# Altium schematic sheet k26_baseboard_cameras.SchDoc: k26 Baseboard Cameras
size A4; DrawnBy: Ch. Vogt; Organization: PBL; DocumentNumber: 1; Revision: r5; SheetNumber: 8
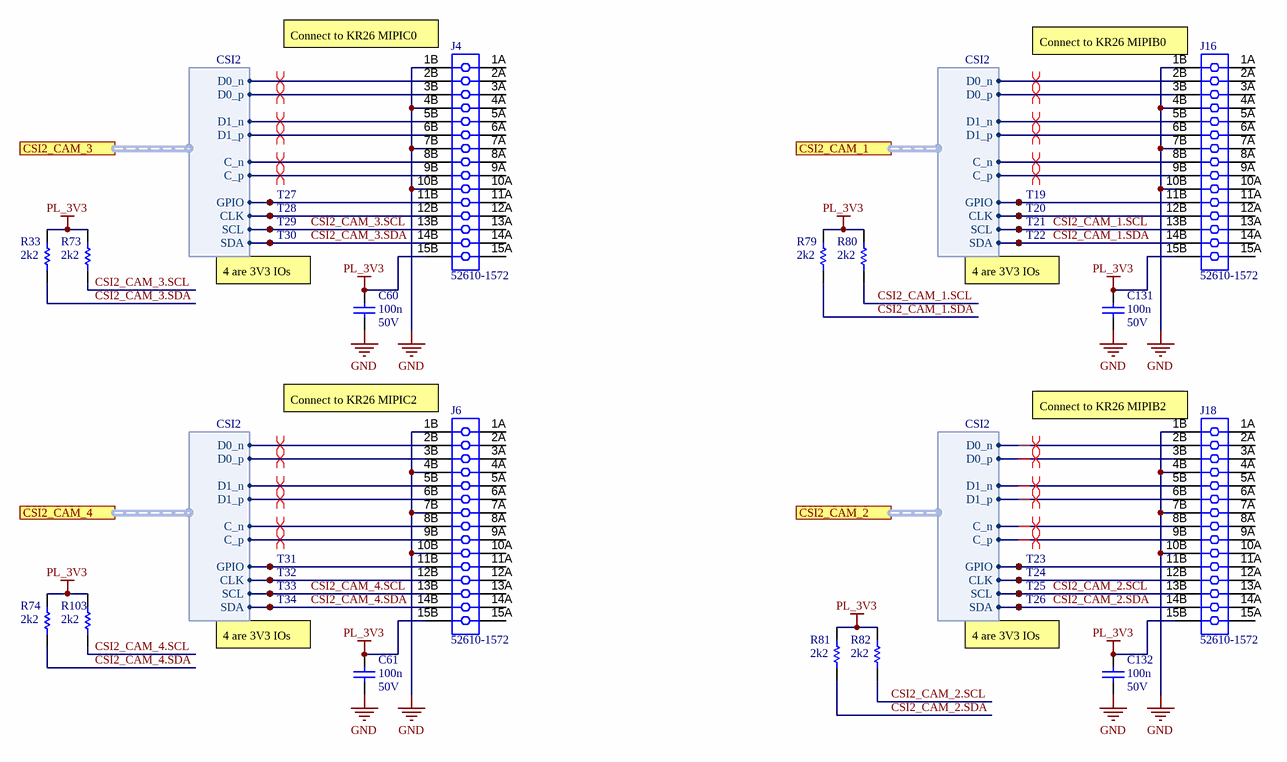
[diagram p0: k26_baseboard_cameras.SchDoc]

## Parts
C60  100n  Rated DC Voltage (URdc): 50V  [CAPC0402]
C61  100n  Rated DC Voltage (URdc): 50V  [CAPC0402]
C131  100n  Rated DC Voltage (URdc): 50V  [CAPC0402]
C132  100n  Rated DC Voltage (URdc): 50V  [CAPC0402]
J4  52610-1572  [MOLX-52610-1572]
J6  52610-1572  [MOLX-52610-1572]
J16  52610-1572  [MOLX-52610-1572]
J18  52610-1572  [MOLX-52610-1572]
R33  2k2  [RES0402]
R73  2k2  [RES0402]
R74  2k2  [RES0402]
R79  2k2  [RES0402]
R80  2k2  [RES0402]
R81  2k2  [RES0402]
R82  2k2  [RES0402]
R103  2k2  [RES0402]
T19  CMP-01283-1  [Pad-1mm]  (value not drawn)  (no BOM)
T20  CMP-01283-1  [Pad-1mm]  (value not drawn)  (no BOM)
T21  CMP-01283-1  [Pad-1mm]  (value not drawn)  (no BOM)
T22  CMP-01283-1  [Pad-1mm]  (value not drawn)  (no BOM)
T23  CMP-01283-1  [Pad-1mm]  (value not drawn)  (no BOM)
T24  CMP-01283-1  [Pad-1mm]  (value not drawn)  (no BOM)
T25  CMP-01283-1  [Pad-1mm]  (value not drawn)  (no BOM)
T26  CMP-01283-1  [Pad-1mm]  (value not drawn)  (no BOM)
T27  CMP-01283-1  [Pad-1mm]  (value not drawn)  (no BOM)
T28  CMP-01283-1  [Pad-1mm]  (value not drawn)  (no BOM)
T29  CMP-01283-1  [Pad-1mm]  (value not drawn)  (no BOM)
T30  CMP-01283-1  [Pad-1mm]  (value not drawn)  (no BOM)
T31  CMP-01283-1  [Pad-1mm]  (value not drawn)  (no BOM)
T32  CMP-01283-1  [Pad-1mm]  (value not drawn)  (no BOM)
T33  CMP-01283-1  [Pad-1mm]  (value not drawn)  (no BOM)
T34  CMP-01283-1  [Pad-1mm]  (value not drawn)  (no BOM)

## Ports
CSI2_CAM_1 (harness CSI2), CSI2_CAM_2 (harness CSI2), CSI2_CAM_3 (harness CSI2), CSI2_CAM_4 (harness CSI2)

## Harnesses
CSI2: D0_n, D0_p, D1_n, D1_p, C_n, C_p, GPIO, CLK, SCL, SDA

## Nets
GND: C60.1 C61.1 C131.1 C132.1 J4.1B J4.4B J4.7B J4.10B J6.1B J6.4B J6.7B J6.10B J16.1B J16.4B J16.7B J16.10B J18.1B J18.4B J18.7B J18.10B
PL_3V3: C60.2 C61.2 C131.2 C132.2 J4.15B J6.15B J16.15B J18.15B R33.2 R73.2 R74.2 R79.2 R80.2 R81.2 R82.2 R103.2
CSI2_CAM_1.SCL: J16.13B R80.1 T21.1 ; port CSI2_CAM_1.SCL
CSI2_CAM_1.SDA: J16.14B R79.1 T22.1 ; port CSI2_CAM_1.SDA
CSI2_CAM_2.SCL: J18.13B R82.1 T25.1 ; port CSI2_CAM_2.SCL
CSI2_CAM_2.SDA: J18.14B R81.1 T26.1 ; port CSI2_CAM_2.SDA
CSI2_CAM_3.SCL: J4.13B R73.1 T29.1 ; port CSI2_CAM_3.SCL
CSI2_CAM_3.SDA: J4.14B R33.1 T30.1 ; port CSI2_CAM_3.SDA
CSI2_CAM_4.SCL: J6.13B R103.1 T33.1 ; port CSI2_CAM_4.SCL
CSI2_CAM_4.SDA: J6.14B R74.1 T34.1 ; port CSI2_CAM_4.SDA
NetJ4_2B: J4.2B ; port CSI2_CAM_3.D0_n
NetJ4_3B: J4.3B ; port CSI2_CAM_3.D0_p
NetJ4_5B: J4.5B ; port CSI2_CAM_3.D1_n
NetJ4_6B: J4.6B ; port CSI2_CAM_3.D1_p
NetJ4_8B: J4.8B ; port CSI2_CAM_3.C_n
NetJ4_9B: J4.9B ; port CSI2_CAM_3.C_p
NetJ4_11B: J4.11B T27.1 ; port CSI2_CAM_3.GPIO
NetJ4_12B: J4.12B T28.1 ; port CSI2_CAM_3.CLK
NetJ6_2B: J6.2B ; port CSI2_CAM_4.D0_n
NetJ6_3B: J6.3B ; port CSI2_CAM_4.D0_p
NetJ6_5B: J6.5B ; port CSI2_CAM_4.D1_n
NetJ6_6B: J6.6B ; port CSI2_CAM_4.D1_p
NetJ6_8B: J6.8B ; port CSI2_CAM_4.C_n
NetJ6_9B: J6.9B ; port CSI2_CAM_4.C_p
NetJ6_11B: J6.11B T31.1 ; port CSI2_CAM_4.GPIO
NetJ6_12B: J6.12B T32.1 ; port CSI2_CAM_4.CLK
NetJ16_2B: J16.2B ; port CSI2_CAM_1.D0_n
NetJ16_3B: J16.3B ; port CSI2_CAM_1.D0_p
NetJ16_5B: J16.5B ; port CSI2_CAM_1.D1_n
NetJ16_6B: J16.6B ; port CSI2_CAM_1.D1_p
NetJ16_8B: J16.8B ; port CSI2_CAM_1.C_n
NetJ16_9B: J16.9B ; port CSI2_CAM_1.C_p
NetJ16_11B: J16.11B T19.1 ; port CSI2_CAM_1.GPIO
NetJ16_12B: J16.12B T20.1 ; port CSI2_CAM_1.CLK
NetJ18_2B: J18.2B ; port CSI2_CAM_2.D0_n
NetJ18_3B: J18.3B ; port CSI2_CAM_2.D0_p
NetJ18_5B: J18.5B ; port CSI2_CAM_2.D1_n
NetJ18_6B: J18.6B ; port CSI2_CAM_2.D1_p
NetJ18_8B: J18.8B ; port CSI2_CAM_2.C_n
NetJ18_9B: J18.9B ; port CSI2_CAM_2.C_p
NetJ18_11B: J18.11B T23.1 ; port CSI2_CAM_2.GPIO
NetJ18_12B: J18.12B T24.1 ; port CSI2_CAM_2.CLK

Not connected (* = marked no-connect by the designer): J4 1A 2A 3A 4A 5A 6A 7A 8A 9A 10A 11A 12A 13A 14A 15A; J6 1A 2A 3A 4A 5A 6A 7A 8A 9A 10A 11A 12A 13A 14A 15A; J16 1A 2A 3A 4A 5A 6A 7A 8A 9A 10A 11A 12A 13A 14A 15A; J18 1A 2A 3A 4A 5A 6A 7A 8A 9A 10A 11A 12A 13A 14A 15A

## Layout directives
differential pair: NetJ4_2B, NetJ4_3B, NetJ4_5B, NetJ4_6B, NetJ4_8B, NetJ4_9B, NetJ6_2B, NetJ6_3B, NetJ6_5B, NetJ6_6B, NetJ6_8B, NetJ6_9B, NetJ16_2B, NetJ16_3B, NetJ16_5B, NetJ16_6B, NetJ16_8B, NetJ16_9B, NetJ18_2B, NetJ18_3B, NetJ18_5B, NetJ18_6B, NetJ18_8B, NetJ18_9B

## Notes on the sheet
- (near J4) Connect to KR26 MIPIC0
- (near J16) Connect to KR26 MIPIB0
- (near T30) 4 are 3V3 IOs
- (near T22) 4 are 3V3 IOs
- (near J6) Connect to KR26 MIPIC2
- (near J18) Connect to KR26 MIPIB2
- (near T34) 4 are 3V3 IOs
- (near T26) 4 are 3V3 IOs
- 1
- 2
- 3
- 4
- A
- B
- C
- Project:
- D
- Date:
- Drawing number:
- Rev:
- Format:
- A4 Q
- Drawn by:
- Laboratory:
- Page
- Sheet:
- of
- File:

## Library data of the parts
C60 C61 C131 C132 = cap0402: Ceramic Capacitor, Multilayer, Ceramic, 50V, 10% +Tol, 10% -Tol, X5R, 15% TC, 0.1uF, Surface Mount, 0402; Manufacturer: Yageo; Manufacturer Part Number: CC0402KRX5R9BB104; Capacitance: 100nF; Multilayer: Yes; Supplier 1: Farnell; Supplier Part Number 1: 3366442; RoHS: Yes; Category: Ceramic Capacitors; Stock 1: 180000; Pricing 1: 10000=0.00890, 50000=0.00870 (CHF); Mount: Surface Mount; Number of Pins: 2; Dielectric Material: Ceramic; Package Shape: Rectangular; Size Code: 0402; Terminal Finish: Nickel; Min Operating Temperature: -55°C; Max Operating Temperature: 85°C; JESD-609 Code: e3; Capacitor Type: Ceramic; Negative Tolerance: 10%; Temperature Characteristics Code: X5R; Termination: Wraparound; Positive Tolerance: 10%; Package Style: SMTMeter; Packaging: Tape and Reel; Length: 1mm; Width: 0.5mm; Height: 0.5mm; Reach SVHC Compliant: Yes; RoHS Compliant: Yes; ComponentLink1URL: https://datasheet.ciiva.com:443/pdfs/VipMasterIC/IC/YAGO/YAGO-S-A0006851646/YAGO-S-A0006851646-1.pdf?src-supplier=IHS+Markit; ComponentLink1Description: https://datasheet.ciiva.com:443/pdfs/VipMasterIC/IC/YAGO/YAGO-S-A0006851646/YAGO-S-A0006851646-1.pdf?src-supplier=IHS+Markit; ComponentLink2URL: http://www.yageo.com/documents/recent/UPY-GPHC_X5R_4V-to-50V_25.pdf?src-supplier=Digi-Key; ComponentLink2Description: http://www.yageo.com/documents/recent/UPY-GPHC_X5R_4V-to-50V_25.pdf?src-supplier=Digi-Key; ComponentLink3URL: http://www.yageo.com/documents/recent/UPY-GPHC_X5R_4V-to-50V_23.pdf?src-supplier=Digi-Key; ComponentLink3Description: http://www.yageo.com/documents/recent/UPY-GPHC_X5R_4V-to-50V_23.pdf?src-supplier=Digi-Key
J4 J6 J16 J18 = CMP-1241-00329-1: 1.0 mm Pitch Easy-On(TM) Type FPC Connector, 5.75 mm Mated Height, Vertical, ZIF, SMT, 15 Circuits, -40 to 85 degC, ELV and RoHS Compliant, Tape and Reel; Manufacturer: Molex; Material - Plating Termination: Tin; Current (Max per Contact): 1A; PCB Retention: None; Pitch - Mating Interface: 1.00mm; Voltage (Max): 125V AC (RMS)/DC; Stackable: No; Durability (mating cycles max): 30; Mated Height: 5.75mm; Circuits (Loaded): 15; Material - Metal: Phosphor Bronze; Material - Plating Mating: Gold; Orientation: Vertical; ComponentLink2Description: Datasheet; Packing: Tape and Reel; ComponentLink3URL: http://www.molex.com/pdm_docs/sd/526101572_sd.pdf; RoHS: TRUE; PartNumber: 52610-1572; Entry Angle: Vertical; ComponentLink1Description: Manufacturer URL; ComponentLink1URL: http://www.molex.com/molex/index.jsp; PackageVersion: Rev. G, 02/2012; Contact Position: N/A; PCB Locator: No; Mounting Technology: Surface Mount; Number of Rows: 1; PackageReference: 52610-1572; PackageDescription: 15-Lead FPC Connector, Pitch 1.0 mm; ComponentLink2URL: http://www.molex.com/webdocs/datasheets/pdf/en-us/0526101572_FFC_FPC_CONNECTORS.pdf; ComponentLink3Description: Package Specification; Polarized to PCB: No
R33 R73 R74 R79-R82 R103 = res0402: Fixed Resistor, Metal Glaze/thick Film, 0.063W, 2200ohm, 50V, 1% +/-Tol, 100ppm/Cel, Surface Mount, 0402; Manufacturer: Vishay; Manufacturer Part Number: CRCW04022K20FKED; Power: 63mW; Value: 2.2kR; Temperature Coefficient: 100ppm/°C; Rated Temperature: 70°C; Package Height: 0.35mm; Package Length: 1mm; Package Width: 0.5mm; Reference Standard: AEC-Q200; Supplier: Farnell; Supplier Part Number: 2121643; RoHS: Yes; Category: Chip SMD Resistors; Stock: 30000; Pricing: 10000=0.00400, 50000=0.00390, 100000=0.00380 (CHF); Mounting Technology: Surface Mount; Pins: 2; Case/Package: 0402; Package Shape: Rectangular; Terminal Finish: Nickel; Min Operating Temperature: -55°C; Max Operating Temperature: 155°C; Tolerance: 1%; Resistor Type: FIXED RESISTOR; Termination: Wraparound; Packaging: Tape and Reel; Technology: METAL GLAZE/THICK FILM; Working Voltage: 50V; Package Style: SMTMeter; Construction: Chip; JESD-609 Code: e3; RoHS Compliant: Yes; Reach SVHC Compliant: Yes
  R33 R74 R79 R81: ComponentLink1URL: https://datasheet.ciiva.com:443/pdfs/VipMasterIC/IC/VISH/VISH-S-A0007266705/VISH-S-A0007266705-1.pdf?src-supplier=IHS+Markit; ComponentLink1Description: https://datasheet.ciiva.com:443/pdfs/VipMasterIC/IC/VISH/VISH-S-A0007266705/VISH-S-A0007266705-1.pdf?src-supplier=IHS+Markit; ComponentLink2URL: https://datasheet.ciiva.com/11811/0900766b80d98824-11811709.pdf?src-supplier=Rs; ComponentLink2Description: https://datasheet.ciiva.com/11811/0900766b80d98824-11811709.pdf?src-supplier=Rs; ComponentLink3URL: https://datasheet.ciiva.com/3256/dcrcwe3-3256341.pdf?src-supplier=Avnet; ComponentLink3Description: https://datasheet.ciiva.com/3256/dcrcwe3-3256341.pdf?src-supplier=Avnet; ComponentLink4URL: https://datasheet.ciiva.com/16209/dcrcwe3-16209157.pdf?src-supplier=Future+Electronics; ComponentLink4Description: https://datasheet.ciiva.com/16209/dcrcwe3-16209157.pdf?src-supplier=Future+Electronics; ComponentLink5URL: https://datasheet.ciiva.com/2464/dcrcwe3-2464486.pdf?src-supplier=Digi-Key; ComponentLink5Description: https://datasheet.ciiva.com/2464/dcrcwe3-2464486.pdf?src-supplier=Digi-Key; ComponentLink6URL: https://datasheet.ciiva.com/2464/dcrcwe3-2464487.pdf?src-supplier=Digi-Key; ComponentLink6Description: https://datasheet.ciiva.com/2464/dcrcwe3-2464487.pdf?src-supplier=Digi-Key; ComponentLink7URL: https://datasheet.ciiva.com/2464/dcrcwe3-2464488.pdf?src-supplier=Digi-Key; ComponentLink7Description: https://datasheet.ciiva.com/2464/dcrcwe3-2464488.pdf?src-supplier=Digi-Key; ComponentLink8URL: https://datasheet.ciiva.com/5541/dcrcwe3-109170-5541416.pdf?src-supplier=Mouser; ComponentLink8Description: https://datasheet.ciiva.com/5541/dcrcwe3-109170-5541416.pdf?src-supplier=Mouser; ComponentLink9URL: https://datasheet.ciiva.com/26316/fld-crcw-e3-data-en-26316650.pdf?src-supplier=Distrelec; ComponentLink9Description: https://datasheet.ciiva.com/26316/fld-crcw-e3-data-en-26316650.pdf?src-supplier=Distrelec; ComponentLink10URL: https://datasheet.ciiva.com/7777/1697337-7777227.pdf?src-supplier=Element14; ComponentLink10Description: https://datasheet.ciiva.com/7777/1697337-7777227.pdf?src-supplier=Element14; ComponentLink11URL: https://datasheet.ciiva.com/7777/1697337-7777228.pdf?src-supplier=Element14; ComponentLink11Description: https://datasheet.ciiva.com/7777/1697337-7777228.pdf?src-supplier=Element14; ComponentLink12URL: https://datasheet.ciiva.com/16778/70201119-16778943.pdf?src-supplier=Allied+Electronics; ComponentLink12Description: https://datasheet.ciiva.com/16778/70201119-16778943.pdf?src-supplier=Allied+Electronics
  R73 R80 R82 R103: ComponentLink1URL: https://datasheet.ciiva.com:443/pdfs/VipMasterIC/IC/PANA/PANA-S-A0009889626/PANA-S-A0009889626-1.pdf?src-supplier=IHS+Markit; ComponentLink1Description: https://datasheet.ciiva.com:443/pdfs/VipMasterIC/IC/PANA/PANA-S-A0009889626/PANA-S-A0009889626-1.pdf?src-supplier=IHS+Markit; ComponentLink2URL: https://datasheet.ciiva.com/6201/426256-6201373.pdf?src-supplier=Farnell; ComponentLink2Description: https://datasheet.ciiva.com/6201/426256-6201373.pdf?src-supplier=Farnell; ComponentLink3URL: https://datasheet.ciiva.com/46377/426256-46377550.pdf?src-supplier=Element14; ComponentLink3Description: https://datasheet.ciiva.com/46377/426256-46377550.pdf?src-supplier=Element14; ComponentLink4URL: https://datasheet.ciiva.com/22749/1678782-22749610.pdf?src-supplier=Element14; ComponentLink4Description: https://datasheet.ciiva.com/22749/1678782-22749610.pdf?src-supplier=Element14; ComponentLink5URL: https://datasheet.ciiva.com/28695/1678782-28695781.pdf?src-supplier=Element14; ComponentLink5Description: https://datasheet.ciiva.com/28695/1678782-28695781.pdf?src-supplier=Element14; ComponentLink6URL: https://datasheet.ciiva.com/16766/70260748-16766015.pdf?src-supplier=Allied+Electronics; ComponentLink6Description: https://datasheet.ciiva.com/16766/70260748-16766015.pdf?src-supplier=Allied+Electronics; ComponentLink7URL: https://datasheet.ciiva.com/16765/70260748-16765054.pdf?src-supplier=Allied+Electronics; ComponentLink7Description: https://datasheet.ciiva.com/16765/70260748-16765054.pdf?src-supplier=Allied+Electronics; ComponentLink8URL: https://datasheet.ciiva.com/9181/aoa0000ce2-9181461.pdf?src-supplier=Avnet; ComponentLink8Description: https://datasheet.ciiva.com/9181/aoa0000ce2-9181461.pdf?src-supplier=Avnet; ComponentLink9URL: https://datasheet.ciiva.com/16508/aoa0000ce2-16508382.pdf?src-supplier=Future+Electronics; ComponentLink9Description: https://datasheet.ciiva.com/16508/aoa0000ce2-16508382.pdf?src-supplier=Future+Electronics; ComponentLink10URL: https://datasheet.ciiva.com:443/pdfs/VipMasterIC/IC/VISH/VISH-S-A0007266705/VISH-S-A0007266705-1.pdf?src-supplier=IHS+Markit; ComponentLink10Description: https://datasheet.ciiva.com:443/pdfs/VipMasterIC/IC/VISH/VISH-S-A0007266705/VISH-S-A0007266705-1.pdf?src-supplier=IHS+Markit; ComponentLink11URL: https://datasheet.ciiva.com/11811/0900766b80d98824-11811709.pdf?src-supplier=Rs; ComponentLink11Description: https://datasheet.ciiva.com/11811/0900766b80d98824-11811709.pdf?src-supplier=Rs; ComponentLink12URL: https://datasheet.ciiva.com/3256/dcrcwe3-3256341.pdf?src-supplier=Avnet; ComponentLink12Description: https://datasheet.ciiva.com/3256/dcrcwe3-3256341.pdf?src-supplier=Avnet; ComponentLink13URL: https://datasheet.ciiva.com/16209/dcrcwe3-16209157.pdf?src-supplier=Future+Electronics; ComponentLink13Description: https://datasheet.ciiva.com/16209/dcrcwe3-16209157.pdf?src-supplier=Future+Electronics; ComponentLink14URL: https://datasheet.ciiva.com/2464/dcrcwe3-2464486.pdf?src-supplier=Digi-Key; ComponentLink14Description: https://datasheet.ciiva.com/2464/dcrcwe3-2464486.pdf?src-supplier=Digi-Key; ComponentLink15URL: https://datasheet.ciiva.com/2464/dcrcwe3-2464487.pdf?src-supplier=Digi-Key; ComponentLink15Description: https://datasheet.ciiva.com/2464/dcrcwe3-2464487.pdf?src-supplier=Digi-Key; ComponentLink16URL: https://datasheet.ciiva.com/2464/dcrcwe3-2464488.pdf?src-supplier=Digi-Key; ComponentLink16Description: https://datasheet.ciiva.com/2464/dcrcwe3-2464488.pdf?src-supplier=Digi-Key; ComponentLink17URL: https://datasheet.ciiva.com/5541/dcrcwe3-109170-5541416.pdf?src-supplier=Mouser; ComponentLink17Description: https://datasheet.ciiva.com/5541/dcrcwe3-109170-5541416.pdf?src-supplier=Mouser; ComponentLink18URL: https://datasheet.ciiva.com/26316/fld-crcw-e3-data-en-26316650.pdf?src-supplier=Distrelec; ComponentLink18Description: https://datasheet.ciiva.com/26316/fld-crcw-e3-data-en-26316650.pdf?src-supplier=Distrelec; ComponentLink19URL: https://datasheet.ciiva.com/7777/1697337-7777227.pdf?src-supplier=Element14; ComponentLink19Description: https://datasheet.ciiva.com/7777/1697337-7777227.pdf?src-supplier=Element14; ComponentLink20URL: https://datasheet.ciiva.com/7777/1697337-7777228.pdf?src-supplier=Element14; ComponentLink20Description: https://datasheet.ciiva.com/7777/1697337-7777228.pdf?src-supplier=Element14; ComponentLink21URL: https://datasheet.ciiva.com/16778/70201119-16778943.pdf?src-supplier=Allied+Electronics; ComponentLink21Description: https://datasheet.ciiva.com/16778/70201119-16778943.pdf?src-supplier=Allied+Electronics
T19-T34 = CMP-01283-1: 1mm SMT Test Pad; Mounting Technology: SMT